# EAGLE design Pico Audio v0.20 (EAGLE 9.4.2)
COMPANY: AKSevenFour; CREVISION: v0.20; DATE: 30-10-2018; DRAWN: Adam Keher; TITLE: TinyPICO Audio Board
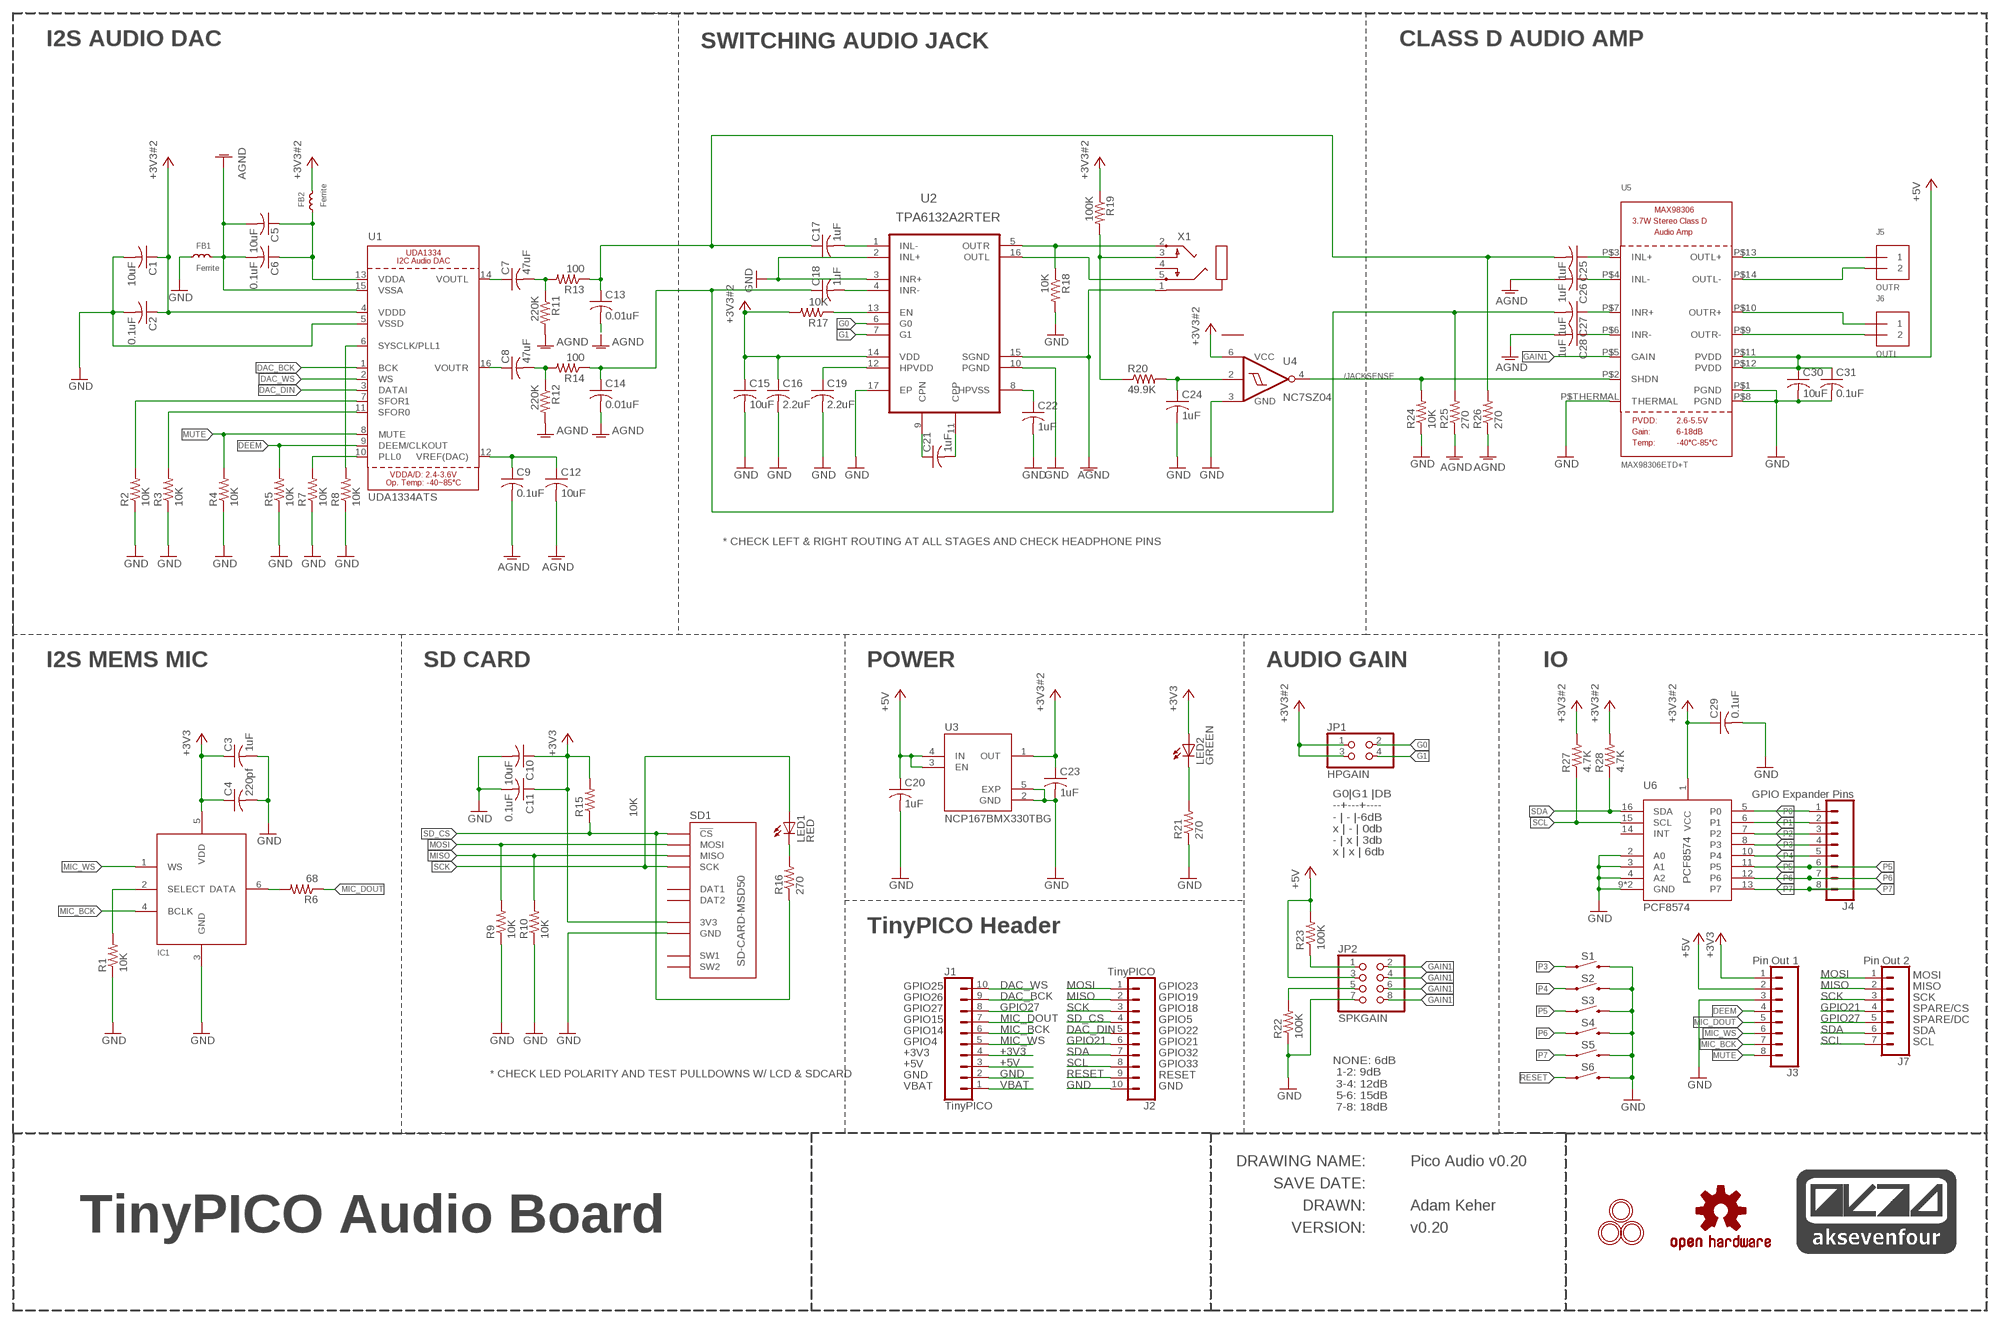
[diagram p0: schematic, sheet 1]

## Parts
AK74LOGO1  AK74_LOGOAK74_LOGO_SMALL  [AK74_LOGO_MEDIUM]
C1  10uF  C-USC0603K  [C0603K]
C2  0.1uF  C-USC0402K  [C0402K]
C3  1uF  C-USC0402K  [C0402K]
C4  220pf  C-USC0402K  [C0402K]
C5  10uF  C-USC0603K  [C0603K]
C6  0.1uF  C-USC0402K  [C0402K]
C7  47uF  C-USC1210K  [C1210K]
C8  47uF  C-USC1210K  [C1210K]
C9  0.1uF  C-USC0402K  [C0402K]
C10  10uF  C-USC0603K  [C0603K]
C11  0.1uF  C-USC0402K  [C0402K]
C12  10uF  C-USC0603K  [C0603K]
C13  0.01uF  C-USC0402K  [C0402K]
C14  0.01uF  C-USC0402K  [C0402K]
C15  10uF  C-USC0603K  [C0603K]
C16  2.2uF  C-USC0402K  [C0402K]
C17  1uF  C-USC0402K  [C0402K]
C18  1uF  C-USC0402K  [C0402K]
C19  2.2uF  C-USC0402K  [C0402K]
C20  1uF  C-USC0402K  [C0402K]
C21  1uF  C-USC0402K  [C0402K]
C22  1uF  C-USC0402K  [C0402K]
C23  1uF  C-USC0402K  [C0402K]
C24  1uF  C-USC0402K  [C0402K]
C25  1uF  C-USC0402K  [C0402K]
C26  1uF  C-USC0402K  [C0402K]
C27  1uF  C-USC0402K  [C0402K]
C28  1uF  C-USC0402K  [C0402K]
C29  0.1uF  C-USC0402K  [C0402K]
C30  10uF  C-USC0603K  [C0603K]
C31  0.1uF  C-USC0402K  [C0402K]
FB1  Ferrite  FERRITEL0805  [R0805]
FB2  Ferrite  FERRITEL0805  [R0805]
IC1  MIC_I2S_SPH0645  [SPH0645LM4H]
J1  TinyPICO  TINYPICO_HEADER_10NO_SILK_PTH_FEMALE  [1X10_NO_SILK]
J2  TinyPICO  TINYPICO_HEADER_10NO_SILK_PTH_FEMALE  [1X10_NO_SILK]
J3  Pin Out 1  CONN_08NO_SILK_FEMALE_PTH  [1X08_NO_SILK]
J4  GPIO Expander Pins  CONN_08NO_SILK_FEMALE_PTH  [1X08_NO_SILK]
J5  OUTR  TERMBLOCK_1X2  [TERMBLOCK_1X2-3.5MM]
J6  OUTL  TERMBLOCK_1X2  [TERMBLOCK_1X2-3.5MM]
J7  Pin Out 2  CONN_07NO_SILK  [1X07_NO_SILK]
JP1  HPGAIN  PINHD-2X2  [2X02]
JP2  SPKGAIN  PINHD-2X4  [2X04]
LED1  RED  LEDCHIP-LED0805  [CHIP-LED0805]
LED2  GREEN  LEDCHIP-LED0805  [CHIP-LED0805]
LOGO1  OSHW-LOGOM  [OSHW-LOGO-M]
MH1  MOUNTINGHOLE2.5  [MOUNTINGHOLE_2.5_PLATED]
MH2  MOUNTINGHOLE2.5  [MOUNTINGHOLE_2.5_PLATED]
MH3  MOUNTINGHOLE2.5  [MOUNTINGHOLE_2.5_PLATED]
R1  10K  R-US_R0402  [R0402]
R2  10K  R-US_R0402  [R0402]
R3  10K  R-US_R0402  [R0402]
R4  10K  R-US_R0402  [R0402]
R5  10K  R-US_R0402  [R0402]
R6  68  R-US_R0402  [R0402]
R7  10K  R-US_R0402  [R0402]
R8  10K  R-US_R0402  [R0402]
R9  10K  R-US_R0402  [R0402]
R10  10K  R-US_R0402  [R0402]
R11  220K  R-US_R0402  [R0402]
R12  220K  R-US_R0402  [R0402]
R13  100  R-US_R0402  [R0402]
R14  100  R-US_R0402  [R0402]
R15  10K  R-US_R0402  [R0402]
R16  270  R-US_R0402  [R0402]
R17  10K  R-US_R0402  [R0402]
R18  10K  R-US_R0402  [R0402]
R19  100K  R-US_R0402  [R0402]
R20  49.9K  R-US_R0402  [R0402]
R21  270  R-US_R0402  [R0402]
R22  100K  R-US_R0402  [R0402]
R23  100K  R-US_R0402  [R0402]
R24  10K  R-US_R0402  [R0402]
R25  270  R-US_R0402  [R0402]
R26  270  R-US_R0402  [R0402]
R27  4.7K  R-US_R0402  [R0402]
R28  4.7K  R-US_R0402  [R0402]
S1  SKSCLDE010  [SKSCLDE010]
S2  SKSCLDE010  [SKSCLDE010]
S3  SKSCLDE010  [SKSCLDE010]
S4  SKSCLDE010  [SKSCLDE010]
S5  SKSCLDE010  [SKSCLDE010]
S6  MOMENTARY-SWITCH-SPST-SMD-4.6X2.8MM  [TACTILE_SWITCH_SMD_4.6X2.8MM]
SD1  SD-CARD-MSD50  [SD_5031821853]
U1  UDA1334ATS  AUDIO_I2S_UDA1334""  [SSOP16_4.4MM]
U2  TPA6132A2RTER  [QFN50P300X300X80-16N]
U3  NCP170AMX300TCG  [VREG_NCP170AMX300TCG]
U4  NC7SZ04  [MICROPAK-6]
U5  MAX98306ETD+T  AUDIOAMP_MAX98306  [TDFN14_3X3MM]
U6  PCF8574  [QFN-16-3MM]
X1  STEREOJACKSTX3120-5B  [STX3100]

## Nets
+3V3 [power1]: C3.1 C4.1 C10.1 C11.1 IC1.5(VDD) J1.4 J3.1 LED2.A R15.2 SD1.VCC(3V3)
+3V3#2 [power1]: C1.1 C2.1 C15.1 C16.1 C23.1 C29.1 FB2.2 JP1.1 JP1.3 R17.2 R19.1 R27.2 R28.2 U1.4(VDDD) U2.14(VDD) U3.1(OUT) U4.6(VCC) U6.1(VCC)
+5V [power1]: C20.1 C30.1 C31.1 J1.3 J3.2 JP2.3 R23.2 U3.3(EN) U3.4(IN) U5.P$11(PVDD) U5.P$12(PVDD)
/JACKSENSE: R24.2 U4.4(Y) U5.P$2(SHDN)
AGND: C5.2 C6.2 C9.2 C12.2 C13.2 C14.2 C26.2 C28.2 FB1.2 R11.2 R12.2 R25.1 R26.1 U1.15(VSSA) U2.15(SGND) X1.1
DAC_BCK: J1.9 U1.1(BCK)
DAC_DIN: J2.5 U1.3(DATAI)
DAC_WS: J1.10 U1.2(WS)
DEEM: J3.4 R5.2 U1.9(DEEM/CLKOUT)
G0: JP1.2 U2.6(G0)
G1: JP1.4 U2.7(G1)
GAIN1: JP2.2 JP2.4 JP2.6 JP2.8 U5.P$5(GAIN)
GND [power1]: C1.2 C2.2 C3.2 C4.2 C10.2 C11.2 C15.2 C16.2 C19.2 C20.2 C22.2 C23.2 C24.2 C29.2 C30.2 C31.2 FB1.1 IC1.3(GND) J1.2 J2.10 J3.3 JP2.7 R1.1 R2.1 R3.1 R4.1 R5.1 R7.1 R8.1 R9.1 R10.1 R18.2 R21.1 R22.1 R24.1 S1.3 S1.4 S2.3 S2.4 S3.3 S3.4 S4.3 S4.4 S5.3 S5.4 S6.3 S6.4 SD1.GND U1.5(VSSD) U2.2(INL+) U2.3(INR+) U2.10(PGND) U2.17(EP) U3.2(GND) U3.5(EXP) U4.3(GND) U5.P$1(PGND) U5.P$8(PGND) U5.P$THERMAL(THERMAL) U6.2(A0) U6.3(A1) U6.4(A2) U6.9(GND) U6.P$1(GND)
GPIO21: J2.6 J7.4
GPIO27: J1.8 J7.5
JACKSENSE: C24.1 R20.2 U4.2(A)
MIC_BCK: IC1.4(BCLK) J1.6 J3.7
MIC_DOUT: J1.7 J3.5 R6.1
MIC_WS: IC1.1(WS) J1.5 J3.6
MISO: J2.2 J7.2 R10.2 SD1.MISO
MOSI: J2.1 J7.1 R9.2 SD1.MOSI
MUTE: J3.8 R4.2 U1.8(MUTE)
N$1: C5.1 C6.1 FB2.1 U1.13(VDDA)
N$2: C25.1 U5.P$3(INL+)
N$3: R2.2 U1.7(SFOR1)
N$4: C27.1 U5.P$7(INR+)
N$5: R3.2 U1.11(SFOR0)
N$6 [power1]: C26.1 U5.P$4(INL-)
N$7 [power1]: C28.1 U5.P$6(INR-)
N$8: LED2.C R21.2
N$9: C17.2 U2.1(INL-)
N$10: R7.2 U1.10(PLL0)
N$11: R8.2 U1.6(SYSCLK/PLL1)
N$12: C18.2 U2.4(INR-)
N$13: R17.1 U2.13(EN)
N$14: C9.1 C12.1 U1.12(VREF(DAC))
N$15: C7.1 U1.14(VOUTL)
N$16: C8.2 R12.1 R14.2
N$17 [power1]: J6.2 U5.P$9(OUTR-)
N$18 [power1]: J5.2 U5.P$14(OUTL-)
N$19: C7.2 R11.1 R13.2
N$20: IC1.2(SELECT) R1.2
N$21: C8.1 U1.16(VOUTR)
N$22: IC1.6(DATA) R6.2
N$23: C19.1 U2.12(HPVDD)
N$24: JP2.1 R23.1
N$25: JP2.5 R22.2
N$26 [power1]: J5.1 U5.P$13(OUTL+)
N$27: LED1.C R16.2
N$28 [power1]: J6.1 U5.P$10(OUTR+)
N$29: R18.1 U2.5(OUTR) X1.2
N$30: U2.16(OUTL) X1.5
N$31: C21.2 U2.11(CPP)
N$32: C21.1 U2.9(CPN)
N$33: C22.1 U2.8(HPVSS)
N$34: R19.2 R20.1 X1.3
P0: J4.1 U6.5(P0)
P1: J4.2 U6.6(P1)
P2: J4.3 U6.7(P2)
P3: J4.4 S1.1 S1.2 U6.8(P3)
P4: J4.5 S2.1 S2.2 U6.10(P4)
P5: J4.6 S3.1 S3.2 U6.11(P5)
P6: J4.7 S4.1 S4.2 U6.12(P6)
P7: J4.8 S5.1 S5.2 U6.13(P7)
RESET: J2.9 S6.1 S6.2
SCK: J2.3 J7.3 LED1.A SD1.SCK
SCL: J2.8 J7.7 R27.1 U6.15(SCL)
SD_CS: J2.4 R15.1 R16.1 SD1.CS(!CS)
SDA: J2.7 J7.6 R28.1 U6.16(SDA)
VBAT [power1]: J1.1
VOUTL [power1]: C13.1 C17.1 C25.2 R13.1 R26.2
VOUTR [power1]: C14.1 C18.1 C27.2 R14.1 R25.2
Unconnected: SD1.DAT1 SD1.DAT2 SD1.SW1 SD1.SW2 U4.1(NC) U4.5(NC) U6.14(INT) X1.4

## Notes on the sheet
- I2S AUDIO DAC | SWITCHING AUDIO JACK | CLASS D AUDIO AMP
- * CHECK LEFT & RIGHT ROUTING AT ALL STAGES AND CHECK HEADPHONE PINS
- I2S MEMS MIC | SD CARD | POWER | AUDIO GAIN | IO
- NCP167BMX330TBG
- G0|G1 |DB
  --+---+----
  - | - |-6dB
  x | - | 0db
  - | x | 3db
  x | x | 6db
- TinyPICO Header
- MOSI
- GPIO25 | GPIO23 | MISO
- GPIO26 | GPIO19 | SCK
- GPIO27 | GPIO18 | SPARE/CS
- GPIO15 | GPIO5 | SPARE/DC
- GPIO14 | GPIO22 | SDA
- GPIO4 | GPIO21 | SCL
- +3V3 | GPIO32
- +5V | GPIO33
- * CHECK LED POLARITY AND TEST PULLDOWNS W/ LCD & SDCARD | GND | RESET
- VBAT | GND
- NONE: 6dB
   1-2: 9dB
   3-4: 12dB
   5-6: 15dB
   7-8: 18dB
- DRAWING NAME:
- SAVE DATE:
- DRAWN:
- VERSION:

## Library data of the parts
AK74LOGO1 = AK74:AK74_LOGO
C1-C31 = rcl:C-US: CAPACITOR, American symbol; SPICEPREFIX: C
FB1 FB2 = AK74:FERRITE
IC1 = microbuilder:MIC_I2S
J1 J2 = UnexpectedMaker:TINYPICO_HEADER_10: Multi connection point. Often used as Generic Header-pin footprint for 0.1 inch spaced/style header connections On any of the 0.1 inch spaced packages, you can populate with these: Break Away Headers - Straight <https://www.sparkfun.com/products/116> (PRT-00116) Break Away Male Headers - Right Angle <https://www.sparkfun.com/products/553> (PRT-00553) Female Headers <https://www.sparkfun.com/products/115> (PRT-00115) Break Away Headers - Machine Pin <https://www.sparkfun.com/products/117> (PRT-00117) Break Away Female Headers - Swiss Machine Pin <https://www.sparkfun.com/products/743> (PRT-00743) Arduino Stackable Header - 10 Pin <https://www.sparkfun.com/products/11376> (PRT-11376) For SCREWTERMINALS and SPRING TERMINALS visit here: Screw Terimnals on SparkFun.com <https://www.sparkfun.com/search/results?term=Screw+Terminals> (5mm/3.5mm/2.54mm spacing) This device is also useful as a general connection point to wire up your design to another part of your project. Our various solder wires solder well into these plated through hole pads. Hook-Up Wire - Assortment (Stranded, 22 AWG) <https://www.sparkfun.com/products/11375> (PRT-11375) Hook-Up Wire - Assortment (Solid Core, 22 AWG) <https://www.sparkfun.com/products/11367> (PRT-11367) View the entire wire category on our website here <https://www.sparkfun.com/categories/141> Special notes: Molex polarized connector foot print use with SKU : PRT-08231 with associated crimp pins and housings. 1MM SMD Version SKU: PRT-10208 NOTES ON THE VARIANTS LOCK and LOCK_LONGPADS... This footprint was designed to help hold the alignment of a through-hole component (i.e. 6-pin header) while soldering it into place. You may notice that each hole has been shifted either up or down by 0.005 of an inch from it's more standard position (which is a perfectly straight line). This slight alteration caused the pins (the squares in the middle) to touch the edges of the holes. Because they are alternating, it causes a "brace" to hold the component in place. 0.005 has proven to be the perfect amount of "off-center" position when using our standard breakaway headers. Although looks a little odd when you look at the bare footprint, once you have a header in there, the alteration is very hard to notice. Also,if you push a header all the way into place, it is covered up entirely on the bottom side.; PROD_ID: CONN-11563
J3 J4 = SparkFun-Connectors:CONN_08: Multi connection point. Often used as Generic Header-pin footprint for 0.1 inch spaced/style header connections On any of the 0.1 inch spaced packages, you can populate with these: Break Away Headers - Straight <https://www.sparkfun.com/products/116> (PRT-00116) Break Away Male Headers - Right Angle <https://www.sparkfun.com/products/553> (PRT-00553) Female Headers <https://www.sparkfun.com/products/115> (PRT-00115) Break Away Headers - Machine Pin <https://www.sparkfun.com/products/117> (PRT-00117) Break Away Female Headers - Swiss Machine Pin <https://www.sparkfun.com/products/743> (PRT-00743) Arduino Stackable Header - 8 Pin <https://www.sparkfun.com/products/9279> (PRT-09279) For SCREWTERMINALS and SPRING TERMINALS visit here: Screw Terimnals on SparkFun.com <https://www.sparkfun.com/search/results?term=Screw+Terminals> (5mm/3.5mm/2.54mm spacing) This device is also useful as a general connection point to wire up your design to another part of your project. Our various solder wires solder well into these plated through hole pads. Hook-Up Wire - Assortment (Stranded, 22 AWG) <https://www.sparkfun.com/products/11375> (PRT-11375) Hook-Up Wire - Assortment (Solid Core, 22 AWG) <https://www.sparkfun.com/products/11367> (PRT-11367) View the entire wire category on our website here <https://www.sparkfun.com/categories/141> Special notes: Molex polarized connector foot print use with SKU : PRT-08231 with associated crimp pins and housings. 1MM SMD Version SKU: PRT-10208 NOTES ON THE VARIANTS LOCK and LOCK_LONGPADS... This footprint was designed to help hold the alignment of a through-hole component (i.e. 6-pin header) while soldering it into place. You may notice that each hole has been shifted either up or down by 0.005 of an inch from it's more standard position (which is a perfectly straight line). This slight alteration caused the pins (the squares in the middle) to touch the edges of the holes. Because they are alternating, it causes a "brace" to hold the component in place. 0.005 has proven to be the perfect amount of "off-center" position when using our standard breakaway headers. Although looks a little odd when you look at the bare footprint, once you have a header in there, the alteration is very hard to notice. Also,if you push a header all the way into place, it is covered up entirely on the bottom side.; PROD_ID: CONN-08438
J5 J6 = microbuilder:TERMBLOCK_1X2: 3.5mm Terminal block http://www.ladyada.net/library/pcb/eaglelibrary.html
J7 = SparkFun-Connectors:CONN_07: Multi connection point. Often used as Generic Header-pin footprint for 0.1 inch spaced/style header connections On any of the 0.1 inch spaced packages, you can populate with these: Break Away Headers - Straight <https://www.sparkfun.com/products/116> (PRT-00116) Break Away Male Headers - Right Angle <https://www.sparkfun.com/products/553> (PRT-00553) Female Headers <https://www.sparkfun.com/products/115> (PRT-00115) Break Away Headers - Machine Pin <https://www.sparkfun.com/products/117> (PRT-00117) Break Away Female Headers - Swiss Machine Pin <https://www.sparkfun.com/products/743> (PRT-00743) For SCREWTERMINALS and SPRING TERMINALS visit here: Screw Terimnals on SparkFun.com <https://www.sparkfun.com/search/results?term=Screw+Terminals> (5mm/3.5mm/2.54mm spacing) This device is also useful as a general connection point to wire up your design to another part of your project. Our various solder wires solder well into these plated through hole pads. Hook-Up Wire - Assortment (Stranded, 22 AWG) <https://www.sparkfun.com/products/11375> (PRT-11375) Hook-Up Wire - Assortment (Solid Core, 22 AWG) <https://www.sparkfun.com/products/11367> (PRT-11367) View the entire wire category on our website here <https://www.sparkfun.com/categories/141> Special notes: Molex polarized connector foot print use with SKU : PRT-08231 with associated crimp pins and housings. 1MM SMD Version SKU: PRT-10208 NOTES ON THE VARIANTS LOCK and LOCK_LONGPADS... This footprint was designed to help hold the alignment of a through-hole component (i.e. 6-pin header) while soldering it into place. You may notice that each hole has been shifted either up or down by 0.005 of an inch from it's more standard position (which is a perfectly straight line). This slight alteration caused the pins (the squares in the middle) to touch the edges of the holes. Because they are alternating, it causes a "brace" to hold the component in place. 0.005 has proven to be the perfect amount of "off-center" position when using our standard breakaway headers. Although looks a little odd when you look at the bare footprint, once you have a header in there, the alteration is very hard to notice. Also,if you push a header all the way into place, it is covered up entirely on the bottom side.
JP1 = pinhead:PINHD-2X2: PIN HEADER
JP2 = pinhead:PINHD-2X4: PIN HEADER
LED1 LED2 = led:LED: LED OSRAM: - CHIPLED LG R971, LG N971, LY N971, LG Q971, LY Q971, LO R971, LY R971 LH N974, LH R974 LS Q976, LO Q976, LY Q976 LO Q996 - Hyper CHIPLED LW Q18S LB Q993, LB Q99A, LB R99A - SideLED LS A670, LO A670, LY A670, LG A670, LP A670 LB A673, LV A673, LT A673, LW A673 LH A674 LY A675 LS A676, LA A676, LO A676, LY A676, LW A676 LS A679, LY A679, LG A679 - Hyper Micro SIDELED® LS Y876, LA Y876, LO Y876, LY Y876 LT Y87S - SmartLED LW L88C, LW L88S LB L89C, LB L89S, LG L890 LS L89K, LO L89K, LY L89K LS L896, LA L896, LO L896, LY L896 - TOPLED LS T670, LO T670, LY T670, LG T670, LP T670 LSG T670, LSP T670, LSY T670, LOP T670, LYG T670 LG T671, LOG T671, LSG T671 LB T673, LV T673, LT T673, LW T673 LH T674 LS T676, LA T676, LO T676, LY T676, LB T676, LH T676, LSB T676, LW T676 LB T67C, LV T67C, LT T67C, LS T67K, LO T67K, LY T67K, LW E67C LS E67B, LA E67B, LO E67B, LY E67B, LB E67C, LV E67C, LT E67C LW T67C LS T679, LY T679, LG T679 LS T770, LO T770, LY T770, LG T770, LP T770 LB T773, LV T773, LT T773, LW T773 LH T774 LS E675, LA E675, LY E675, LS T675 LS T776, LA T776, LO T776, LY T776, LB T776 LHGB T686 LT T68C, LB T68C - Hyper Mini TOPLED® LB M676 - Mini TOPLED Santana® LG M470 LS M47K, LO M47K, LY M47K Source: http://www.osram.convergy.de LUXEON: - LUMILED® LXK2-PW12-R00, LXK2-PW12-S00, LXK2-PW14-U00, LXK2-PW14-V00 LXK2-PM12-R00, LXK2-PM12-S00, LXK2-PM14-U00 LXK2-PE12-Q00, LXK2-PE12-R00, LXK2-PE12-S00, LXK2-PE14-T00, LXK2-PE14-U00 LXK2-PB12-K00, LXK2-PB12-L00, LXK2-PB12-M00, LXK2-PB14-N00, LXK2-PB14-P00, LXK2-PB14-Q00 LXK2-PR12-L00, LXK2-PR12-M00, LXK2-PR14-Q00, LXK2-PR14-R00 LXK2-PD12-Q00, LXK2-PD12-R00, LXK2-PD12-S00 LXK2-PH12-R00, LXK2-PH12-S00 LXK2-PL12-P00, LXK2-PL12-Q00, LXK2-PL12-R00 Source: www.luxeon.com KINGBRIGHT: KA-3528ASYC Source: www.kingbright.com
LOGO1 = SparkFun-Aesthetics:OSHW-LOGO: Open-Source Hardware (OSHW) Logo This logo indicates the piece of hardware it is found on incorporates a OSHW license and/or adheres to the definition of open source hardware found here: http://freedomdefined.org/OSHW
MH1-MH3 = microbuilder:MOUNTINGHOLE: Mounting Hole For #2 screws (0.086"/2.18mm width, 0.094"/2.4mm hole) use 2.5mm
R1-R28 = rcl:R-US_: RESISTOR, American symbol; SPICEPREFIX: R
S1-S5 = AK74:SKSCLDE010
S6 = SparkFun-Switches:MOMENTARY-SWITCH-SPST: Momentary Switch (Pushbutton) - SPST Normally-open (NO) SPST momentary switches (buttons, pushbuttons). Variants PTH-12MM - 12mm square, through-hole Momentary Pushbutton Switch - 12mm Square <https://www.sparkfun.com/products/9190> (COM-09190) PTH-6.0MM, PTH-6.0MM-KIT - 6.0mm square, through-hole Mini Pushbutton Switch <https://www.sparkfun.com/products/97> (COM-00097) KIT package intended for soldering kit's - only one side of pads' copper is exposed. PTH-RIGHT-ANGLE-KIT - Right-angle, through-hole Right Angle Tactile Button <https://www.sparkfun.com/products/10791> - Used on SparkFun BigTime Watch Kit <https://www.sparkfun.com/products/11734> SMD-12MM - 12mm square, surface-mount Tactile Button - SMD (12mm) <https://www.sparkfun.com/products/12993> (COM-12993) Used on SparkFun PicoBoard <https://www.sparkfun.com/products/11888> SMD-4.5MM - 4.5mm Square Trackball Switch Used on SparkFun Blackberry Trackballer Breakout <https://www.sparkfun.com/products/13169> SMD-4.6MMX2.8MM - 4.60mm x 2.80mm, surface mount Used on SparkFun SAMD21 Mini Breakout <https://www.sparkfun.com/products/13664> SMD-5.2MM, SMD-5.2-REDUNDANT - 5.2mm square, surface-mount Mini Pushbutton Switch - SMD <https://www.sparkfun.com/products/8720> (COM-08720) Used on Arduino Pro Mini <https://www.sparkfun.com/products/11114> REDUNDANT package connects both switch circuits together SMD-6.0X3.5MM - 6.0 x 3.5mm, surface mount Momentary Reset Switch SMD <https://www.sparkfun.com/products/8229> (COM-08229) SMD-6.2MM-TALL - 6.2mm square, surface mount Tactile Button - SMD (6mm) <https://www.sparkfun.com/products/12992> Used on SparkFun Digital Sandbox <https://www.sparkfun.com/products/12651> SMD-RIGHT-ANGLE - Right-angle, surface mount Used on SparkFun Block for Intel® Edison - Arduino <https://www.sparkfun.com/products/13036>; PROD_ID: SWCH-13065
SD1 = we-con:SD-CARD: SD-Card Sockets; DIGIKEY: WM9750TR-ND
U1 = microbuilder:AUDIO_I2S_UDA1334: UDA1334 I2C Audio DAC Power Supply: 2.4-3.6V Sample frequencies from 16-100kHz
U2 = TPA6132A2RTER:TPA6132A2RTER: 25-mW DIRECTPATH? STEREO HEADPHONE AMPLIFIER WITH POP SUPPRESSION; AVAILABILITY: Unavailable; DESCRIPTION: 25-mW DirectPath Stereo Headphone Amplifier with Pop Suppression _TPA6132_ 16-WQFN -40 to 85; MF: Texas Instruments; MP: TPA6132A2RTER; PACKAGE: WQFN-16 Texas Instruments; PRICE: None
U3 = NCP170AMX300TCG:NCP170AMX300TCG: Fixed LDO Voltage Regulator, 2.2V to 5.5V, 190mV Dropout, 3Vout, 150mAout, XDFN-4; AVAILABILITY: Unavailable; DESCRIPTION: Fixed LDO Voltage Regulator, 2.2V to 5.5V, 190mV Dropout, 3Vout, 150mAout, XDFN-4; MF: ON Semiconductor; MP: NCP170AMX300TCG; PACKAGE: XDFN-4 ON Semiconductor; PRICE: None
U4 = AK74:NC7SZ04
U5 = microbuilder:AUDIOAMP_MAX98306: MAX98306 3.7W Stereo Audio Amp - TDFN14 3.7W @ 3 ohm, 2.6-5.5V supply, 6-18dB selectable gain
U6 = AK74:PCF8574
X1 = AK74:STEREOJACK: MIC/HEADPHONE JACK Stereo jack with two switches. Kycon STX3100, CUI SJ1-3555NG and/or 4UCon 05544

## Net classes
0 default: width 0.152 mm
1 power1: width 0.254 mm

## Board
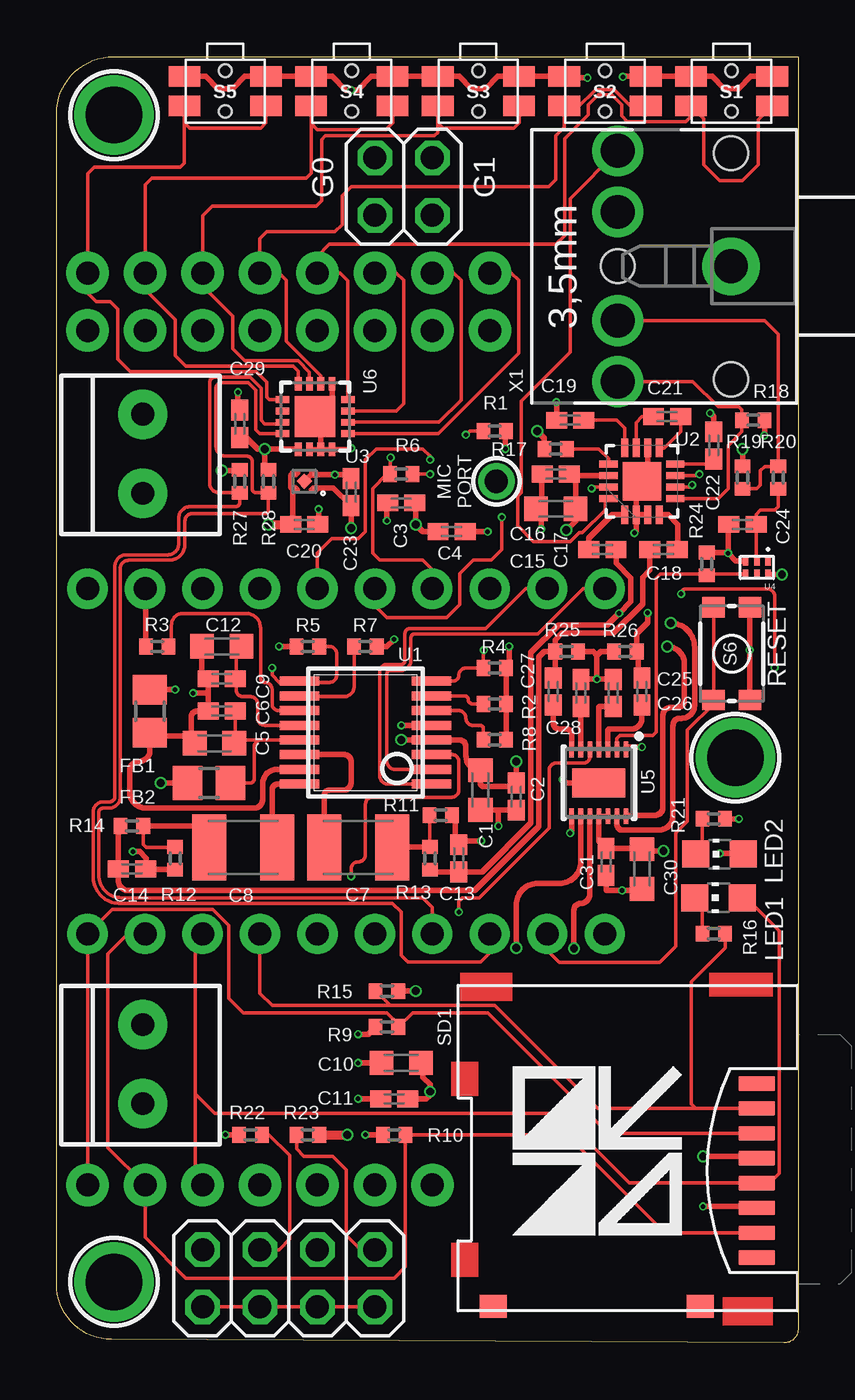
[diagram p1: board, top side]
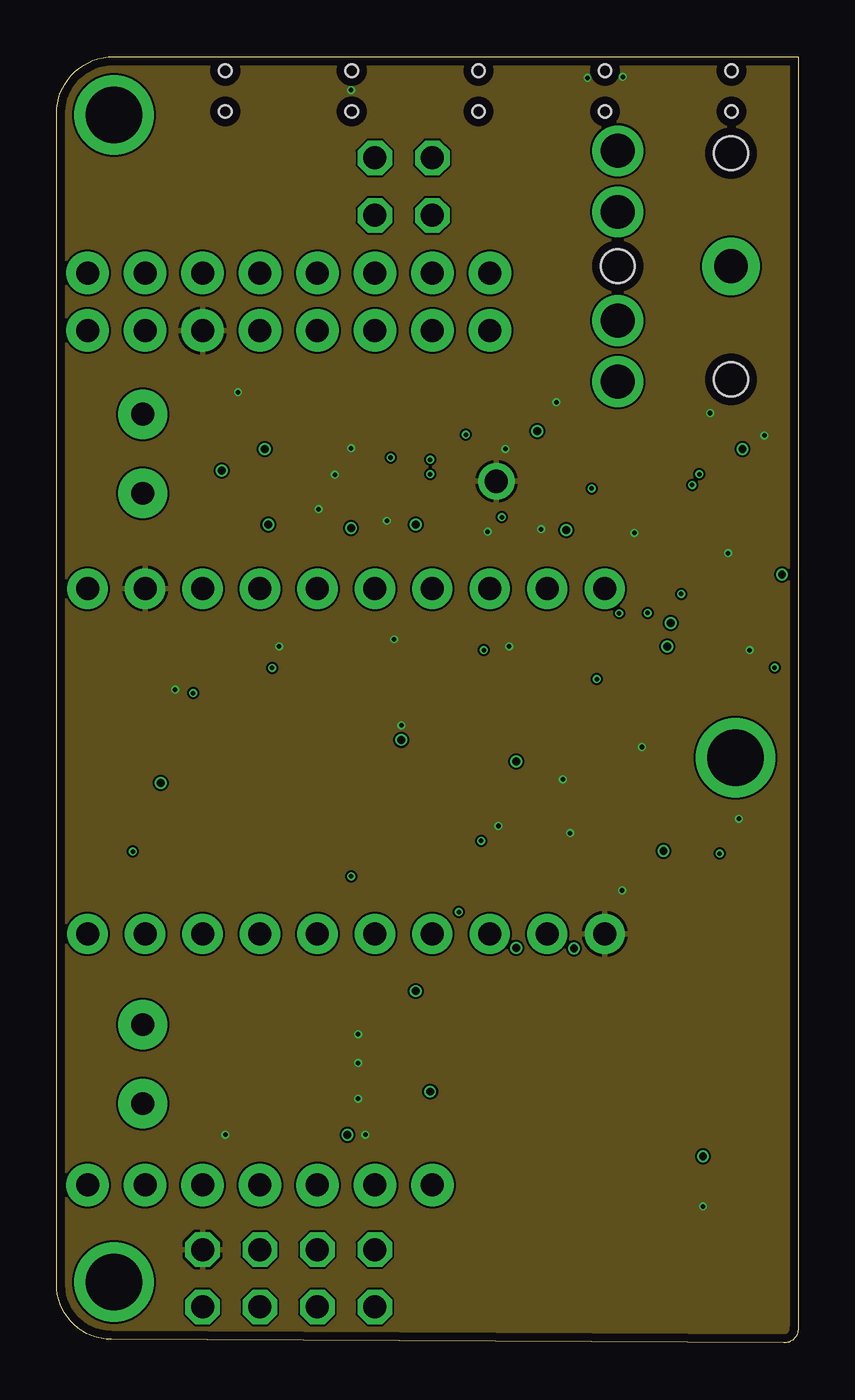
[diagram p2: board, inner layer GND]
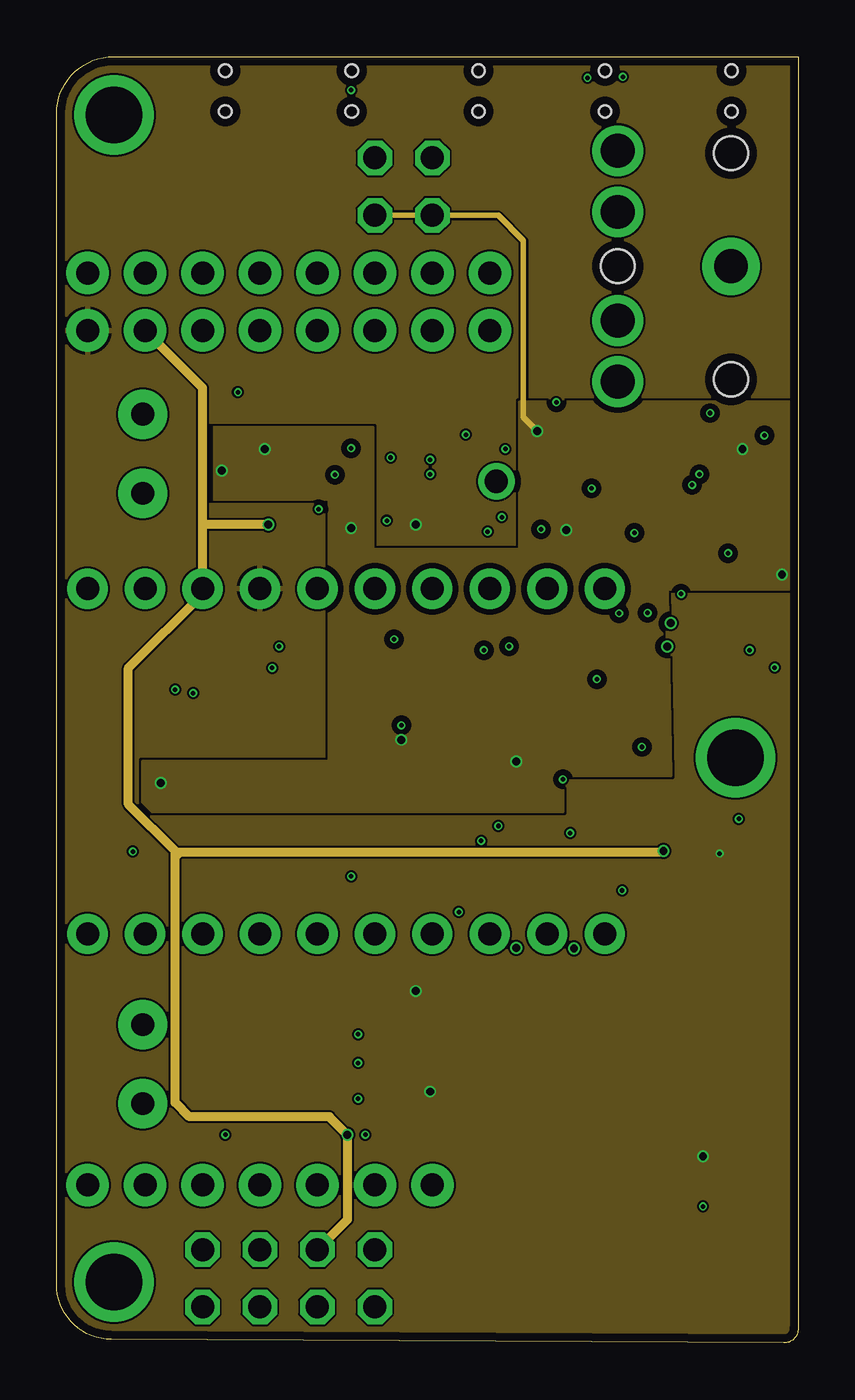
[diagram p3: board, inner layer PWR]
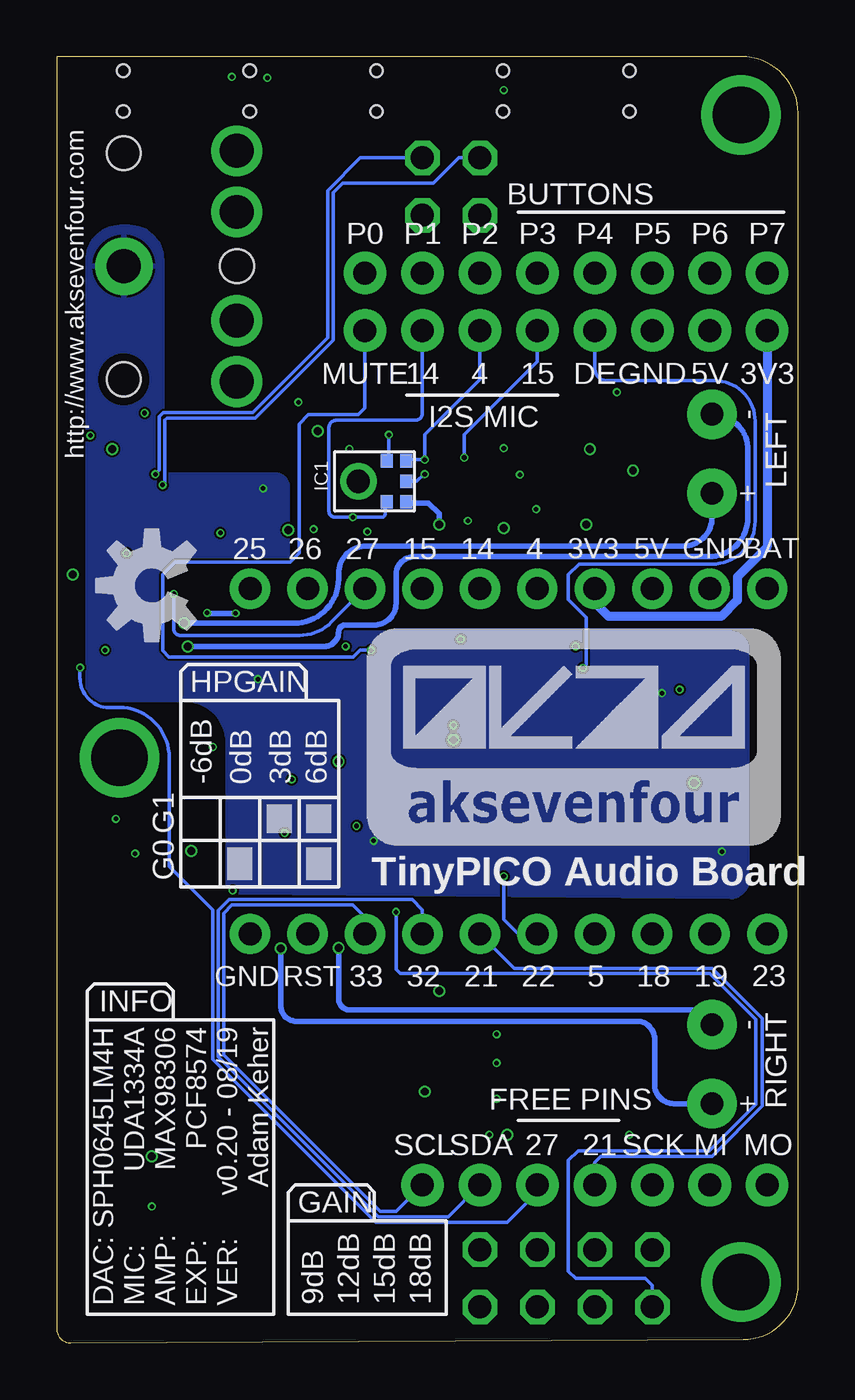
[diagram p4: board, bottom side, seen from below]

Size 32.79 x 56.89 mm. Coordinates in mm from the lower left corner, seen from the top.
Outline: 0,2.59 0,54.37 arc-90 2.52,56.88 32.78,56.88 32.78,0.63 arc-90 32.15,0 2.43,0.16 arc-90 0,2.59
Copper layers (1+2*15+16): Top 0.07mm / dielectric 1.5mm / GND 0.035mm / dielectric 0.15mm / PWR 0.035mm / dielectric 0.2mm / Bottom 0.07mm
Design rules "jlcpcb-4layer-updated": minimum track width 3.5mil, minimum drill 0.2mm, track to track 3.5mil, track to pad 5mil, pad to pad 5mil, via to via 5mil, smd to smd 5mil, copper to edge 15mil, drill to drill 5mil, minimum pad ring 7mil, minimum via ring 3mil, stop-mask expansion 3mil, vias tented up to drill 20mil, thermal gap 5mil

### Footprints (pad centres in the part's own frame; a part is rotated, then mirrored left to right if it is on the bottom)
C0603K = smd 1.05 x 1.08: 1 -0.875,0; 2 0.875,0
C0402K = smd 0.925 x 0.74: 1 -0.6,0; 2 0.6,0
C1210K = smd 1.5 x 2.9: 1 -1.5,0; 2 1.5,0
R0805 = smd 1.3 x 1.5: 1 -0.95,0; 2 0.95,0
SPH0645LM4H = smd 0.6 x 0.525: 1 -0.9,1.4; 2 -0.9,0.55; 4 0.9,0.55; 5 0.9,1.4; 6 0,1.4 | drill 1.025 pad 1.625: 3 0,-0.71
1X10_NO_SILK = drill 1.016 pad 1.778: 1 0,0; 2 2.54,0; 3 5.08,0; 4 7.62,0; 5 10.16,0; 6 12.7,0; 7 15.24,0; 8 17.78,0; 9 20.32,0; 10 22.86,0
1X08_NO_SILK = drill 1.016 pad 1.88: 1 0,0; 2 2.54,0; 3 5.08,0; 4 7.62,0; 5 10.16,0; 6 12.7,0; 7 15.24,0; 8 17.78,0
TERMBLOCK_1X2-3.5MM = drill 1 pad 2.184: 1 1.8,0; 2 -1.7,0
1X07_NO_SILK = drill 1.016 pad 1.88: 1 0,0; 2 2.54,0; 3 5.08,0; 4 7.62,0; 5 10.16,0; 6 12.7,0; 7 15.24,0
2X02 = drill 1.016 octagon: 1 -1.27,-1.27; 2 -1.27,1.27; 3 1.27,-1.27; 4 1.27,1.27
2X04 = drill 1.016 octagon: 1 -3.81,-1.27; 2 -3.81,1.27; 3 -1.27,-1.27; 4 -1.27,1.27; 5 1.27,-1.27; 6 1.27,1.27; 7 3.81,-1.27; 8 3.81,1.27
CHIP-LED0805 = smd 1.2 x 1.2: A 0,-1.05; C 0,1.05
MOUNTINGHOLE_2.5_PLATED = drill 2.5 pad 3.2: P$1 0,0
R0402 = smd 0.6 x 0.7: 1 -0.5,0; 2 0.5,0
SKSCLDE010 = smd 1.4 x 0.9: 1 -1.8,0.65; 2 1.8,0.65; 3 -1.8,-0.65; 4 1.8,-0.65 | hole 0.55: 0,0.9; 0,-0.9
TACTILE_SWITCH_SMD_4.6X2.8MM = smd 0.9 x 1: 1 -2.05,-0.8; 2 2.05,-0.8; 3 2.05,0.8; 4 -2.05,0.8
SD_5031821853 = smd 0.65 x 1.6: CS 2.75,0.8; DAT1 -3.85,0.8; DAT2 3.85,0.8; GND -1.65,0.8; MISO -2.75,0.8; MOSI 1.65,0.8; SCK -0.55,0.8; VCC 0.55,0.8 | smd 1 x 1.2: SW1 -6,12.45; SW2 -6,3.3
SSOP16_4.4MM = smd 0.4 x 1.75: 1 -2.275,-2.92; 2 -1.625,-2.92; 3 -0.975,-2.92; 4 -0.325,-2.92; 5 0.325,-2.92; 6 0.975,-2.92; 7 1.625,-2.92; 8 2.275,-2.92; 9 2.275,2.92; 10 1.625,2.92; 11 0.975,2.92; 12 0.325,2.92; 13 -0.325,2.92; 14 -0.975,2.92; 15 -1.625,2.92; 16 -2.275,2.92
QFN50P300X300X80-16N = smd 0.813 x 0.305: 1 -1.473,0.762; 2 -1.473,0.254; 3 -1.473,-0.254; 4 -1.473,-0.762; 9 1.473,-0.762; 10 1.473,-0.254; 11 1.473,0.254; 12 1.473,0.762 | smd 0.305 x 0.813: 5 -0.762,-1.473; 6 -0.254,-1.473; 7 0.254,-1.473; 8 0.762,-1.473; 13 0.762,1.473; 14 0.254,1.473; 15 -0.254,1.473; 16 -0.762,1.473 | smd 1.702 x 1.702: 17 0,0
VREG_NCP170AMX300TCG = smd 0.152 x 0.152: 1 -0.45,0.3; 2 -0.45,-0.3; 3 0.45,-0.3; 4 0.45,0.3 | smd 0.483 x 0.483 rotated 315: 5 0,0
MICROPAK-6 = smd 0.41 x 0.3: 1 -0.295,0.5; 2 -0.295,0; 3 -0.295,-0.5; 4 0.295,-0.5; 5 0.295,0; 6 0.295,0.5
TDFN14_3X3MM = smd 0.7 x 0.2: P$1 -1.475,1.2; P$2 -1.475,0.8; P$3 -1.475,0.4; P$4 -1.475,0; P$5 -1.475,-0.4; P$6 -1.475,-0.8; P$7 -1.475,-1.2; P$8 1.475,-1.2; P$9 1.475,-0.8; P$10 1.475,-0.4; P$11 1.475,0; P$12 1.475,0.4; P$13 1.475,0.8; P$14 1.475,1.2 | smd 1.27 x 2.35: P$THERMAL 0,0
QFN-16-3MM = smd 0.6 x 0.3: 1 -1.45,0.75; 2 -1.45,0.25; 3 -1.45,-0.25; 4 -1.45,-0.75; 9 1.45,-0.75; 10 1.45,-0.25; 11 1.45,0.25; 12 1.45,0.75 | smd 0.3 x 0.6: 5 -0.75,-1.45; 6 -0.25,-1.45; 7 0.25,-1.45; 8 0.75,-1.45; 13 0.75,1.45; 14 0.25,1.45; 15 -0.25,1.45; 16 -0.75,1.45 | smd 1.8 x 1.8: P$1 0,0
STX3100 = drill 1.5 pad 2.54: 1 2.7,-0.1 | drill 1.5: 2 7.7,5; 3 7.7,2.3; 4 7.7,-2.5; 5 7.7,-5.2 | hole 1.5: 2.7,4.9; 2.7,-5.1; 7.7,-0.1

### Placement (x,y rotation side)
AK74LOGO1  10.16,28.35 0 bottom
C1  18.73,24.45 270 top
C2  20.32,24.16 270 top
C3  15.24,37.15 180 top
C4  17.46,35.88 0 top
C5  6.99,26.51 180 top
C6  7.3,27.94 180 top
C7  13.34,21.91 0 top
C8  8.26,21.91 180 top
C9  7.3,29.37 180 top
C10  15.24,12.38 180 top
C11  14.92,10.8 180 top
C12  7.3,30.8 180 top
C13  17.78,21.43 90 top
C14  3.33,20.96 0 top
C15  22.07,36.89 180 top
C16  22.07,38.42 180 top
C17  24.13,35.09 180 top
C18  26.83,35.09 0 top
C19  22.7,40.8 180 top
C20  10.95,36.2 0 top
C21  26.99,40.96 180 top
C22  29.05,39.69 90 top
C23  13.02,37.63 90 top
C24  30.32,36.2 180 top
C25  25.88,28.81 90 top
C26  24.61,28.74 90 top
C27  21.96,28.81 90 top
C28  23.18,28.74 90 top
C29  8.1,40.64 90 top
C30  25.88,20.96 270 top
C31  24.29,21.27 270 top
FB1  4.13,27.94 270 top
FB2  6.74,24.77 180 top
IC1  18.73,38.1 270 bottom
J1  1.37,33.35 0 top
J2  1.37,18.09 0 top
J3  1.37,44.77 0 top
J4  19.15,47.31 180 top
J5  3.81,39.37 270 top
J6  3.81,12.38 270 top
J7  1.37,6.99 0 top
JP1  15.34,51.13 0 top
JP2  10.26,2.86 180 top
LED1  29.26,19.69 90 top
LED2  29.3,21.62 90 top
LOGO1  28.57,33.5 90 bottom
MH1  30,25.88 0 top
MH2  2.54,2.7 0 top
MH3  2.54,54.29 0 top
R1  19.37,40.32 180 top
R2  19.37,28.26 180 top
R3  4.45,30.8 0 top
R4  19.37,29.85 180 top
R5  11.11,30.8 0 top
R6  15.24,38.42 0 top
R7  13.65,30.8 180 top
R8  19.37,26.67 180 top
R9  14.61,13.97 0 top
R10  14.92,9.21 0 top
R11  16.99,23.34 0 top
R12  5.24,21.43 270 top
R13  16.51,21.43 90 top
R14  3.33,22.86 0 top
R15  14.61,15.56 0 top
R16  29.05,18.1 180 top
R17  22.07,39.53 180 top
R18  30.8,40.8 0 top
R19  30.32,38.26 270 top
R20  31.91,38.26 270 top
R21  29.05,23.18 180 top
R22  8.57,9.21 0 top
R23  11.11,9.21 0 top
R24  28.73,34.45 270 top
R25  22.54,30.57 180 top
R26  25.15,30.57 0 top
R27  8.1,38.1 90 top
R28  9.37,38.1 90 top
S1  29.84,55.35 180 top
S2  24.24,55.35 180 top
S3  18.65,55.35 180 top
S4  13.05,55.35 180 top
S5  7.45,55.35 180 top
S6  29.84,30.48 270 top
SD1  31.75,7.62 90 top
U1  13.65,26.99 90 top
U2  25.88,38.1 90 top
U3  10.95,38.1 180 top
U4  30.96,34.29 270 top
U5  23.97,24.77 270 top
U6  11.43,40.96 90 top
U$1  [AK74_LOGO_MEDIUM_TEXTONLY_SQUARE]  27.46,10.64 0 top
X1  32.51,47.51 180 top

### Tracks (layer width: path | path; a pad name or v marks a point on that pad's centre or on a via)
+3V3  (via drill 0.2, 0.35)
  Top 0.254: C11.1 16.35,10.8 16.51,10.96 v16.51,11.11 16.51,11.43 16.19,11.75 16.19,12.31 C10.1 | R15.2 v15.88,15.56 | v28.57,8.26 30.86,8.26 SD1.VCC | C3.1 15.88,37.11 v15.88,36.2 16.19,35.88 C4.1 | v29.31,21.64 30.32,21.64 LED2.A
  Bottom 0.254: IC1.5 17.28,37.15 16.35,37.15 15.88,36.67 v15.88,36.2
  Bottom 0.406: J1.4 8.99,32.74 8.38,32.13 3.41,32.13 2.69,32.85 2.69,33.87 1.37,35.19 J3.1
  pour PWR (rank 3): -1.27,58.26 -1.27,-1.11 33.97,-1.11 33.97,58.26
+3V3#2  (via drill 0.35)
  Top 0.254: FB2.2 v4.6,24.77 | v15.24,26.67 U1.4 | U1.4 | U1.4 arc-90 U1.4 | U1.4 17.78,26.67 arc-90 18.1,26.35 18.1,25.96 arc90 C1.1 18.73,24.77 arc90 18.89,24.61 20.17,24.61 arc90 C2.1 v20.32,25.72 | U3.1 12.24,37.8 C23.1 v13.02,36.04 | v9.21,39.53 8.89,39.53 8.38,40.04 C29.1 | v9.21,39.53 10.66,39.53 U6.1 | R28.2 arc-90 9.21,38.76 v9.21,39.53 | R27.2 arc-90 8.07,38.58 v7.3,38.58 | v30.32,39.53 R19.1 | R17.2 21.57,40 v21.25,40.32 | v32.07,33.97 31.48,33.97 U4.6 | U2.14 22.73,38.36 C16.1 | C16.1 22.67,38.26 | v22.54,35.94 22.94,36.35 C15.1 22.94,38.14 C16.1
  PWR 0.254: JP1.1 JP1.3 19.51,49.86 20.64,48.74 20.64,40.93 v21.25,40.32
  pour PWR (isolate 0.254): 3.81,25.72 3.81,23.5 22.38,23.5 22.38,25.08 27.15,25.08 26.99,33.18 26.99,33.34 33.18,33.34 33.18,41.59 20.48,41.59 20.48,35.09 13.97,35.09 13.97,40.48 6.35,40.48 6.35,37.31 12.06,37.31 12.06,25.72
+5V  (via drill 0.35)
  Top 0.254: C20.1 10.43,36.27 10.43,37.73 U3.4 10.39,37.8 10.36,37.84 10.36,38.37 10.39,38.4 U3.3 | U5.P$12 U5.P$11 23.97,22.19 C31.1 25.83,21.87 C30.1 25.96,21.75 v26.83,21.75
  Top 0.406: v9.37,36.2 C20.1 | R23.2 v12.86,9.21
  PWR 0.406: v26.83,21.75 26.77,21.69 5.45,21.69 5.24,21.48 | 5.24,21.48 5.24,10.64 5.87,10 12.06,10 v12.86,9.21 12.86,5.46 JP2.3 | 5.24,21.48 5.24,21.75 3.17,23.81 3.17,29.85 6.45,33.12 J1.3 6.45,36.2 | 6.45,36.2 6.45,42.23 J3.2 | v9.37,36.2 6.45,36.2
/JACKSENSE
  Top 0.152: U5.P$2 24.77,26.73 24.89,26.86 26.36,26.86 26.51,27.01 26.51,33.82 26.69,34 28.69,34 R24.2 28.78,34 U4.4
AGND  (via drill 0.2)
  Top 0.152: U2.15 23.72,37.85 v23.65,37.78 | 3.96,20.93 C14.2
  Top 0.254: v18.77,22.2 17.95,22.2 C13.2 17.62,22.19 17.62,23.2 R11.2 | U1.15 9.75,25.36 arc90 9.11,24.72 9.11,24.03 arc-90 8.72,23.65 3.98,23.65 arc-90 3.23,24.4 3.23,25.29 arc-90 3.65,25.72 arc90 4.13,26.2 FB1.2 4.29,26.83 5.79,26.83 C5.2 5.95,26.67 5.95,27.67 arc-90 6.23,27.94 C6.2 6.7,28.74 | C12.2 6.43,29.65 arc90 C9.2 6.7,28.74 | 6.7,28.74 v6.04,28.74 v6.03,28.74 | C28.2 23.2,29.36 v23.89,29.36 | v23.89,29.36 23.89,30.4 | R26.1 24.06,30.57 23.89,30.4 | 23.89,30.4 23.72,30.57 R25.1 | v23.89,29.36 24.58,29.36 C26.2 | R12.2 3.96,20.93 | v3.37,21.72 3.68,21.72 3.97,21.43 3.97,20.99 C14.2
  pour Bottom: 22.54,31.43 3.02,31.43 arc90 2.22,30.64 2.22,20.48 arc91 3.01,19.69 24.8,19.9 arc89 25.24,20.34 25.24,26.53 arc-90 27.13,28.42 31.43,28.42 31.43,47.91 arc90 29.97,49.37 29.57,49.37 arc90 28.1,47.91 28.1,38.42 23.08,38.42 arc90 22.54,37.88
DAC_BCK
  Top 0.152: U1.1 14.66,24.71 arc-90 14.29,25.08 14.29,29.69 arc-90 14.61,30.01 15.24,30.01 arc90 15.4,30.16 15.4,31.37 arc-90 15.62,31.59 18.98,31.59 20.74,33.35 J1.9
DAC_DIN  (via drill 0.2)
  Top 0.152: U1.3 17.48,26.01 arc-90 17.78,25.72 17.78,24.45 arc-90 17.46,24.13 13.97,24.13 arc90 13.65,23.81 13.65,21.59 arc-90 13.34,21.27 arc90 13.02,20.96 v13.02,20.64
  Bottom 0.152: v13.02,20.64 13.02,18.73 12.37,18.09 J2.5
DAC_WS
  Top 0.152: U1.2 14.96,25.36 arc-90 14.61,25.72 14.61,29.62 arc-90 14.73,29.74 15.22,29.74 arc90 15.66,30.18 15.66,31.19 arc-90 15.83,31.35 21.28,31.35 23.28,33.35 J1.10
DEEM  (via drill 0.2)
  Top 0.152: U1.9 10.82,29.18 10.85,29.21 | v9.53,29.85 9.53,29.53 9.84,29.21 10.85,29.21 | R5.2 12.06,30.8 arc-90 12.38,30.48 12.38,29.53 arc-90 12.06,29.21 10.85,29.21
  Bottom 0.152: v9.53,29.85 9.37,30.01 9.37,32.07 10.16,32.86 10.16,33.97 9.69,34.44 3.8,34.44 arc-90 1.91,36.34 1.91,40.76 arc-90 3.69,42.55 8.44,42.55 arc90 8.99,43.09 J3.4
G0  (via drill 0.2)
  Top 0.152: v28.1,37.94 28.01,37.85 U2.6
  Bottom 0.152: JP1.2 15.01,52.4 16.14,51.28 20.14,51.28 20.55,50.86 20.55,44.35 24.01,40.9 27.9,40.9 28,40.8 28,38.04 v28.1,37.94
G1  (via drill 0.2)
  Top 0.152: U2.7 28.35,38.36 v28.42,38.42
  Bottom 0.152: v28.42,38.42 28.24,38.6 28.24,40.96 28.06,41.14 24.11,41.14 20.8,44.45 20.8,50.96 19.36,52.4 JP1.4
GAIN1  (via drill 0.2)
  Top 0.152: JP2.2 JP2.4 JP2.6 JP2.8 | U5.P$5 23.57,25.91 arc-90 23.3,25.64 22.09,25.64 arc90 21.78,25.33 21.78,22.78 18.69,19.69 17.94,19.69 17.78,19.53 v17.78,19.05
  Bottom 0.152: v17.78,19.05 17.78,16.51 17.6,16.33 3.91,16.33 1.88,14.3 1.88,10.54 3.92,8.5 9.73,8.5 10.16,8.07 10.16,3.18 9.84,2.86 6.77,2.86 6.45,2.54 JP2.8
GND  (via drill 0.2)
  Top 0.254: S6.3 v30.64,30.64 S6.4 | v20,30.8 20,29.98 R4.1 R2.1 R8.1 | U1.5 v15.24,27.31 | v14.92,31.12 14.61,30.8 R7.1 | v9.84,30.8 R5.1 | R10.1 v13.65,9.21 | v28.57,6.03 30.89,6.03 SD1.GND | C10.2 v13.34,12.38 | C11.2 v13.34,10.8 | U5.P$1 25.28,26.35 v25.88,26.35 | U5.P$THERMAL 22.54,24.77 v22.38,24.93 | U5.P$8 22.77,22.61 v22.7,22.54 | C31.2 24.29,20.04 24.32,20.01 v25,20.01 25.8,20.01 C30.2 | R22.1 v7.46,9.21 | C1.2 19.53,23.57 | 19.53,23.57 20.3,23.57 arc-90 C2.2 | FB1.1 v5.24,28.89 arc-90 v5.24,28.89 | R21.1 v30.16,23.18 | R3.1 3.94,33.32 arc90 J1.2 | C3.2 14.61,37.11 v14.61,36.36 | v19.05,35.88 C4.2 | R1.1 19.84,40.3 v19.84,39.53 | R9.1 13.79,13.65 v13.34,13.65 | v11.59,36.87 11.59,36.23 C20.2 | C23.2 12.85,38.39 v12.31,38.39 12.3,38.4 U3.2 11.25,38.4 U3.5 | v13.02,39.57 12.96,39.51 U6.4 U6.3 | U6.3 11.68,40.71 U6.P$1 12.18,41.71 U6.9 | C29.2 8.02,41.32 v8.02,42.04 | U6.2 U6.3 | v19.53,22.86 19.53,23.57 | v31.29,40.13 v31.3,40.14 R18.2 | C24.2 29.69,36.16 v29.69,34.93 | v28.89,41.12 29.05,40.96 C22.2 | U2.10 26.13,38.1 U2.17 25.72,38.1 | 25.62,38.1 25.72,38.1 | C16.2 21.44,38.39 21.44,36.92 C15.2 21.42,36.84 v21.42,35.98 | v22.09,41.59 22.1,41.58 C19.2 | U4.3 30.03,34.59 v29.69,34.93 | R24.1 29.66,34.95 v29.69,34.93 | S5.4 6.6,56 7.13,55.47 7.78,55.47 8.31,56 S5.3 S4.4 12.19,56 12.79,55.41 v13.02,55.41 13.31,55.41 13.91,56 S4.3 S3.4 17.79,56 18.32,55.47 18.97,55.47 19.5,56 S3.3 S2.4 22.51,55.94 v23.47,55.94 | S1.3 30.7,56 30.16,55.47 29.51,55.47 28.98,56 S1.4 28,56.04 27.46,56.04 27.43,56 S2.3 25.05,56 v25.03,55.99 | U2.2 U2.3 | U2.2 25.62,38.01 25.72,38.1 | U2.2 25.62,35.9 v25.55,35.82
  pour GND (rank 2): -0.64,57.63 -0.64,-0.47 33.34,-0.47 33.34,57.63
GPIO21
  Bottom 0.152: J2.6 12.56,16.57 3.81,16.57 1.59,14.35 1.59,10.48 3.81,8.26 8.73,8.26 8.99,8 J7.4
GPIO27  (via drill 0.2)
  Top 0.152: v27.6,33.12 arc-90 27.82,33.34 31.43,33.34 arc-90 31.74,33.03 v31.74,29.87
  Bottom 0.152: J7.5 11.53,6.67 12.86,5.34 18.67,5.34 25.88,12.55 25.88,19.14 27.8,21.06 27.8,25.88 arc-45 28.46,27.47 arc-45 29.99,28.1 30.48,28.1 arc90 31.74,29.36 31.75,29.36 v31.75,29.86 v31.74,29.87 | J1.8 20.63,31.87 arc45 22.05,31.29 27.3,31.29 arc90 27.61,31.59 27.61,33.11 v27.6,33.12
JACKSENSE
  Top 0.152: U4.2 30.92,34.62 C24.1 30.92,36.64 31.11,36.83 31.75,36.83 31.91,36.99 R20.2
MIC_BCK  (via drill 0.2)
  Top 0.152: J1.6 14.07,32.6 14.61,32.07 17.25,32.07 17.83,32.65 17.83,34.02 18.41,34.61 19.21,34.61 19.68,35.09 v19.68,36.51
  Bottom 0.152: IC1.4 18.26,37.13 18.26,36.67 arc90 18.41,36.51 v19.68,36.51 20.48,36.51 arc90 20.75,36.78 20.75,40.47 arc90 20.41,40.8 16.93,40.8 arc-90 16.61,41.12 J3.7
MIC_DOUT  (via drill 0.2)
  Top 0.152: J1.7 16.61,34.19 16.19,34.61 14.29,34.61 13.97,34.93 13.97,37.78 14.61,38.42 R6.1 14.74,39.13 v14.76,39.15
  Bottom 0.152: v14.76,39.15 14.76,40.17 11.53,43.4 J3.5
MIC_WS  (via drill 0.2)
  Top 0.152: J1.5 11.53,34.94 12.15,35.56 13.34,35.56 13.65,35.88 13.65,39.05 14.13,39.53 16.19,39.53 16.51,39.21 v16.51,39.05
  Bottom 0.152: IC1.1 17.28,39.05 v16.51,39.05 16.51,40.17 14.07,42.6 J3.6
MISO
  Top 0.152: SD1.MISO 26.88,4.87 22.54,9.21 R10.2 15.42,3.36 14.92,2.86 5.71,2.86 3.91,4.66 J7.2 2.26,8.64 2.26,17.21 3.14,18.09 J2.2
MOSI
  Top 0.152: SD1.MOSI 24.39,9.27 19.05,14.61 15.74,14.61 R9.2 15.11,14.11 14.61,14.61 8.26,14.61 7.62,15.24 7.62,18.46 6.9,19.18 2.46,19.18 J2.1 J7.1
MUTE  (via drill 0.2)
  Top 0.152: U1.8 17.52,29.26 arc90 17.78,29.53 arc-90 18.1,29.85 R4.2 18.87,30.62 v18.89,30.64
  Bottom 0.152: J3.8 19.15,41.33 19.44,41.04 21.67,41.04 22.07,40.64 22.07,38.42 22.07,34.93 22.46,34.53 27.54,34.53 28.1,33.97 28.1,30.62 27.82,30.33 19.67,30.33 19.37,30.64 v18.89,30.64
N$1
  Top 0.152: FB2.1 8.57,24.77 arc90 8.74,24.93 8.74,26.19 arc90 8.73,26.2 8.73,26.35 arc-90 9.05,26.67 | U1.13 arc90 U1.13 9.05,26.67 | C6.1 7.9,26.67 | 7.9,26.67 7.9,26.56 C5.1 | 9.05,26.67 7.9,26.67
N$2
  Top 0.254: U5.P$3 24.37,27.07 arc-90 24.45,27.15 25.4,27.15 arc90 25.88,27.62 C25.1
N$3
  Top 0.152: R2.2 18.39,28.26 arc-90 18.2,28.46 arc90 18.04,28.61 U1.7
N$4
  Top 0.254: U5.P$7 22.77,26.92 arc90 22.54,27.15 22.23,27.15 arc-90 21.96,27.41 C27.1
N$5
  Top 0.152: U1.11 9.82,27.96 arc-90 9.53,28.26 9.53,28.89 arc90 9.21,29.21 arc-90 9.02,29.4 9.02,31.62 arc90 8.38,32.26 5.59,32.26 arc90 5.08,31.75 5.08,30.93 arc-90 R3.2
N$6
  Top 0.254: U5.P$4 23.97,28.1 arc-90 24.01,28.14 C26.1
N$7
  Top 0.254: U5.P$6 C28.1 arc-90 C28.1
N$8
  Top 0.152: R21.2 28.55,21.92 LED2.C
N$9
  Top 0.254: C17.2 23.53,35.6 24.56,36.63 U2.1
N$10
  Top 0.152: R7.2 13.15,29.03 arc-90 12.7,28.58 10.77,28.58 U1.10
N$11
  Top 0.152: U1.6 17.76,27.96 arc-90 18.1,27.62 arc90 18.41,27.31 18.73,27.31 arc-90 18.87,27.17 R8.2
N$12
  Top 0.254: U2.4 27.03,36.63 27.46,36.2 27.46,35.12 C18.2
N$13
  Top 0.152: R17.1 23.97,39.53 24.4,39.1 U2.13
N$14
  Top 0.152: U1.12 9.2,27.31 arc-90 8.89,27.62 8.89,28.26 arc90 8.57,28.58 8.26,28.58 arc-90 7.94,28.89 7.94,29.34 arc90 C9.1 arc90 7.94,29.41 7.94,30.56 arc90 C12.1
N$15
  Top 0.254: U1.14 12.72,26.01 arc-90 13.02,25.72 13.02,24.77 arc-90 12.7,24.45 12.06,24.45 arc90 11.84,24.22 C7.1
N$16
  Top 0.152: R14.2 3.83,22.04 3.97,21.91 5.21,21.91 R12.1
  Top 0.254: R14.2 6.35,22.86 6.75,22.46 C8.2
N$17  (via drill 0.35)
  Top 0.254: U5.P$9 23.17,21.27 arc-90 22.23,20.32 21.27,20.32 arc90 20.32,19.37 v20.32,17.46
  Bottom 0.254: v20.32,17.46 20.32,15.24 arc-90 19.8,14.72 4.45,14.72 arc90 J6.2
N$18  (via drill 0.35)
  Top 0.254: U5.P$14 25.2,23.33 26.43,23.33 arc90 26.8,23.7 26.8,27.76 arc-90 27.15,28.1 27.44,28.1 arc90 27.76,28.42 27.76,30.03 arc90 v26.99,30.8
  Bottom 0.254: v26.99,30.8 20.95,30.8 arc-90 20.32,31.43 arc90 20,31.75 18.73,31.75 arc-90 17.78,32.7 17.78,33.97 arc90 16.99,34.77 3.97,34.77 arc-90 2.22,36.51 2.22,39.48 arc-90 J5.2
N$19
  Top 0.152: 14.86,21.93 arc90 C7.2 | R13.2 16.49,21.96 R11.1
  Top 0.254: 14.86,21.93 R13.2
N$20  (via drill 0.2)
  Top 0.152: v18.1,40.17 18.26,40.32 R1.2
  Bottom 0.152: IC1.2 18.1,39.09 v18.1,40.17
N$21
  Top 0.152: 9.53,22.14 arc90 C8.1
  Top 0.254: U1.16 9.79,24.71 arc90 9.53,24.45 9.53,22.14
N$22  (via drill 0.2)
  Top 0.152: v16.51,38.42 R6.2
  Bottom 0.152: v16.51,38.42 16.54,38.42 16.86,38.1 IC1.6
N$23
  Top 0.152: U2.12 25.11,40.45 24.77,40.8 C19.1
N$24
  Top 0.152: R23.1 10.61,8.57 10.93,8.26 12.2,8.26 12.8,7.65 12.8,5.4 12.8,4.76 13.44,4.13 JP2.1
N$25
  Top 0.152: R22.2 9.39,9.21 10.31,8.29 10.31,4.6 9.84,4.13 JP2.5
N$26  (via drill 0.35)
  Top 0.254: U5.P$13 24.77,22.92 arc90 25.01,22.68 26.62,22.68 arc90 27.25,23.31 27.25,27.31 arc-90 27.57,27.62 27.62,27.62 arc90 28.2,28.2 28.2,30.77 arc90 v27.15,31.83
  Bottom 0.254: J5.1 3.81,36.51 arc90 5.08,35.24 19.09,35.24 arc-90 20.32,34.01 20.32,33.79 arc90 22.28,31.83 v27.15,31.83
N$27
  Top 0.152: LED1.C 28.55,19.35 R16.2
N$28  (via drill 0.35)
  Top 0.254: U5.P$10 23.57,19.84 arc-90 23.16,19.43 arc90 22.87,19.14 v22.87,17.45
  Bottom 0.254: v22.87,17.45 22.87,14.91 arc-90 22.19,14.23 7.14,14.23 arc90 6.35,13.44 6.35,11.43 arc-90 5.5,10.58 J6.1
N$29
  Top 0.152: U2.5 29.24,37.34 29.69,37.78 29.69,39.69 30.3,40.3 R18.1 30.3,41.27 30.16,41.41 29.24,41.41 28.13,42.51 X1.2
N$30
  Top 0.152: X1.5 22.7,50.6 22.7,43.82 20.53,41.65 20.53,37.6 20.38,37.44 20.38,36.14 21.08,35.43 22.71,35.43 23.11,35.84 23.24,35.84 24.24,36.84 24.24,37.18 U2.16
N$31
  Top 0.152: C21.2 25.88,40.96 25.62,40.71 U2.11
N$32
  Top 0.152: U2.9 26.87,39.57 27.59,40.29 C21.1
N$33
  Top 0.152: C22.1 28.9,38.86 U2.8
N$34
  Top 0.152: X1.3 31.31,45.21 31.91,44.61 R20.1 31.3,38.76 31.11,38.58 31.11,37.94 30.96,37.78 30.34,37.78 R19.2
P0
  Top 0.152: U6.5 16.87,40.21 20.42,43.76 20.42,46.99 20.1,47.31 J4.1
P1
  Top 0.152: U6.6 16.89,40.71 17.88,41.7 17.88,46.99 17.56,47.31 J4.2
P2
  Top 0.152: J4.3 15.02,47.31 15.34,46.99 15.34,41.54 15.01,41.21 U6.7
P3
  Top 0.152: U6.8 12.88,46.97 12.54,47.31 J4.4 11.53,48.05 12.06,48.58 22.07,48.58 22.46,48.97 22.46,53.26 23.18,53.98 23.51,54.31 23.51,54.76 23.94,55.19 24.55,55.19 24.98,54.76 24.98,54.27 25.23,54.01 27.82,54.01 28.04,54.23 S1.2 28.61,54.14 28.61,52.11 29.31,51.41 30.31,51.41 31.02,52.11 31.02,54.09 S1.1
P4
  Top 0.152: U6.10 11.68,42.77 10.16,44.29 10.16,46.99 9.84,47.31 J4.5 8.99,48.84 9.29,49.13 12.3,49.13 12.62,49.45 12.62,50.72 13.02,51.12 21.75,51.12 22.07,51.43 22.07,53.38 22.44,53.75 22.44,54.61 | 22.44,54.61 S2.2 | S2.1 25.37,54.7 24.65,55.43 23.84,55.43 23.02,54.61 22.44,54.61
P5
  Top 0.152: U6.11 11.18,42.93 10.68,43.43 8.32,43.43 7.78,43.98 7.78,45.4 6.45,46.73 J4.6 6.45,49.85 6.88,50.27 11.48,50.27 11.72,50.51 11.72,53.21 11.88,53.37 16.7,53.37 16.85,53.52 16.85,53.98 | S3.1 20.45,53.95 20.22,53.72 17.1,53.72 16.85,53.98 | 16.85,53.98 S3.2
P6
  Top 0.152: U6.12 10.68,42.98 10.47,43.19 5.71,43.19 5.24,43.66 5.24,45.25 3.91,46.57 J4.7 3.91,51.22 4.21,51.52 11.03,51.52 11.25,51.73 S4.2 11.25,53.93 11.53,53.66 14.56,53.66 14.85,53.95 S4.1
P7
  Top 0.152: U6.13 9.41,41.71 9.29,41.83 9.29,42.49 8.83,42.95 3.25,42.95 2.7,43.5 2.7,45.72 2.38,46.04 1.75,46.04 1.37,46.41 J4.8 1.37,51.7 1.67,51.99 5.48,51.99 5.66,52.17 S5.2 5.66,53.95 5.88,53.72 9.03,53.72 9.26,53.95 S5.1
RESET
  Top 0.152: S6.1 S6.2 29.05,28.25 27.89,27.1 27.89,23.05 27.38,22.54 27.38,17.54 26.67,16.83 22.23,16.83 21.69,17.36 J2.9
SCK
  Top 0.152: 6.13,11.01 6.99,10.16 22.23,10.16 25.32,7.07 SD1.SCK 31.52,7.08 31.95,7.51 31.95,18.21 30.48,19.69 LED1.A | J2.3 6.13,17.77 6.13,11.01 | 6.13,11.01 6.13,7.3 J7.3
SCL
  Top 0.152: J2.8 19.15,17.25 18.76,16.85 15.53,16.85 15.24,17.15 15.24,19.05 14.85,19.45 2.76,19.45 arc-90 1.63,20.58 1.63,23.5 arc-90 2.06,23.93 2.34,23.93 arc90 2.58,24.17 2.58,34.35 arc-90 3.08,34.85 4.92,34.85 arc90 5.4,35.33 5.4,36.45 arc-90 5.94,36.99 7.94,36.99 arc90 8.1,37.15 R27.1 7.17,37.6 arc-90 6.78,37.99 6.78,42.5 arc-90 6.99,42.71 8.57,42.71 9.05,42.23 9.05,40.8 9.21,40.64 9.91,40.64 U6.15
  Bottom 0.152: J7.7 17.78,5.82 18.47,5.82 25.4,12.75 25.4,19 25.03,19.37 19.68,19.37 19.15,18.84 J2.8
SD_CS
  Top 0.152: J2.4 8.99,15.46 9.53,14.92 14.74,14.92 | 14.74,14.92 19.37,14.92 23.92,10.37 28.26,10.37 | R16.1 29.55,17.46 28.05,15.96 28.05,10.58 28.26,10.37 | R15.1 14.74,14.92 | SD1.CS 28.26,10.37
SDA
  Top 0.152: J2.7 16.61,19.27 16.19,19.69 2.86,19.69 arc-90 1.87,20.68 1.87,23.46 arc-90 2.06,23.65 2.31,23.65 arc90 2.82,24.16 2.82,34.25 arc-90 3.17,34.61 4.98,34.61 arc90 5.68,35.31 5.68,36.37 arc-90 5.98,36.67 9.21,36.67 arc90 9.37,36.83 R28.1 8.82,37.6 arc-90 8.65,37.77 8.65,38.98 arc90 8.41,39.21 7.48,39.21 arc-90 7.05,39.64 7.05,42.23 arc-90 7.28,42.46 8.47,42.46 8.81,42.13 8.81,40.38 8.98,40.21 U6.16
  Bottom 0.152: J7.6 15.48,5.58 18.57,5.58 25.64,12.65 25.64,19.13 25.16,19.61 17.07,19.61 16.61,19.15 J2.7
VOUTL  (via drill 0.2)
  Top 0.254: R13.1 16.61,20.83 C13.1 18.81,20.83 20.96,22.99 20.96,30.52 22.19,31.75 24.35,31.75 v24.86,32.27 25.39,32.79 25.39,33.83 24.73,34.49 C17.1 | C25.2 25.72,29.57 25.72,30.5 R26.2 25.65,31.36 26.13,31.85 v26.13,32.28
  Bottom 0.254: v26.13,32.28 26.11,32.25 24.88,32.25 v24.86,32.27
VOUTR
  Top 0.254: R14.1 2.73,22.76 C14.1 2.73,20.45 arc90 3.17,20 18.48,20 21.31,22.84 21.31,30.32 21.56,30.57 R25.2 | R25.2 22.04,31.09 22.34,31.39 24.62,31.39 25.9,32.68 25.9,33.84 26.23,34.17 C18.1 | C27.2 22.04,29.5 R25.2

### Text on the board
bPlace: http://www.aksevenfour.com
tNames: G0 | G1 | MIC / PORT | RESET
bNames: BUTTONS | P7 | P6 | P5 | P4 | P3 | P2 | P1 | P0 | 3V3 | 5V | GND | DE | 15 | 4 | 14 | MUTE | I2S MIC | - | LEFT | + | BAT | GND | 5V | 3V3 | 4 | 14 | 15 | 27 | 26 | 25 | HPGAIN | 6dB | 3dB | 0dB | -6dB | G1 | TinyPICO Audio Board | G0 | 23 | 19 | 18 | 5 | 22 | 21 | 32 | 33 | RST | GND | INFO | - | SPH0645LM4H / UDA1334A / MAX98306 / PCF8574 / v0.20 - 08/19 / Adam Keher | RIGHT | + | FREE PINS | MO | MI | SCK | 21 | 27 | SDA | SCL | GAIN | 18dB | 15dB | 12dB | 9dB | DAC: / MIC: / AMP: / EXP: / VER: